# EAGLE design scr (EAGLE 7.4.0)
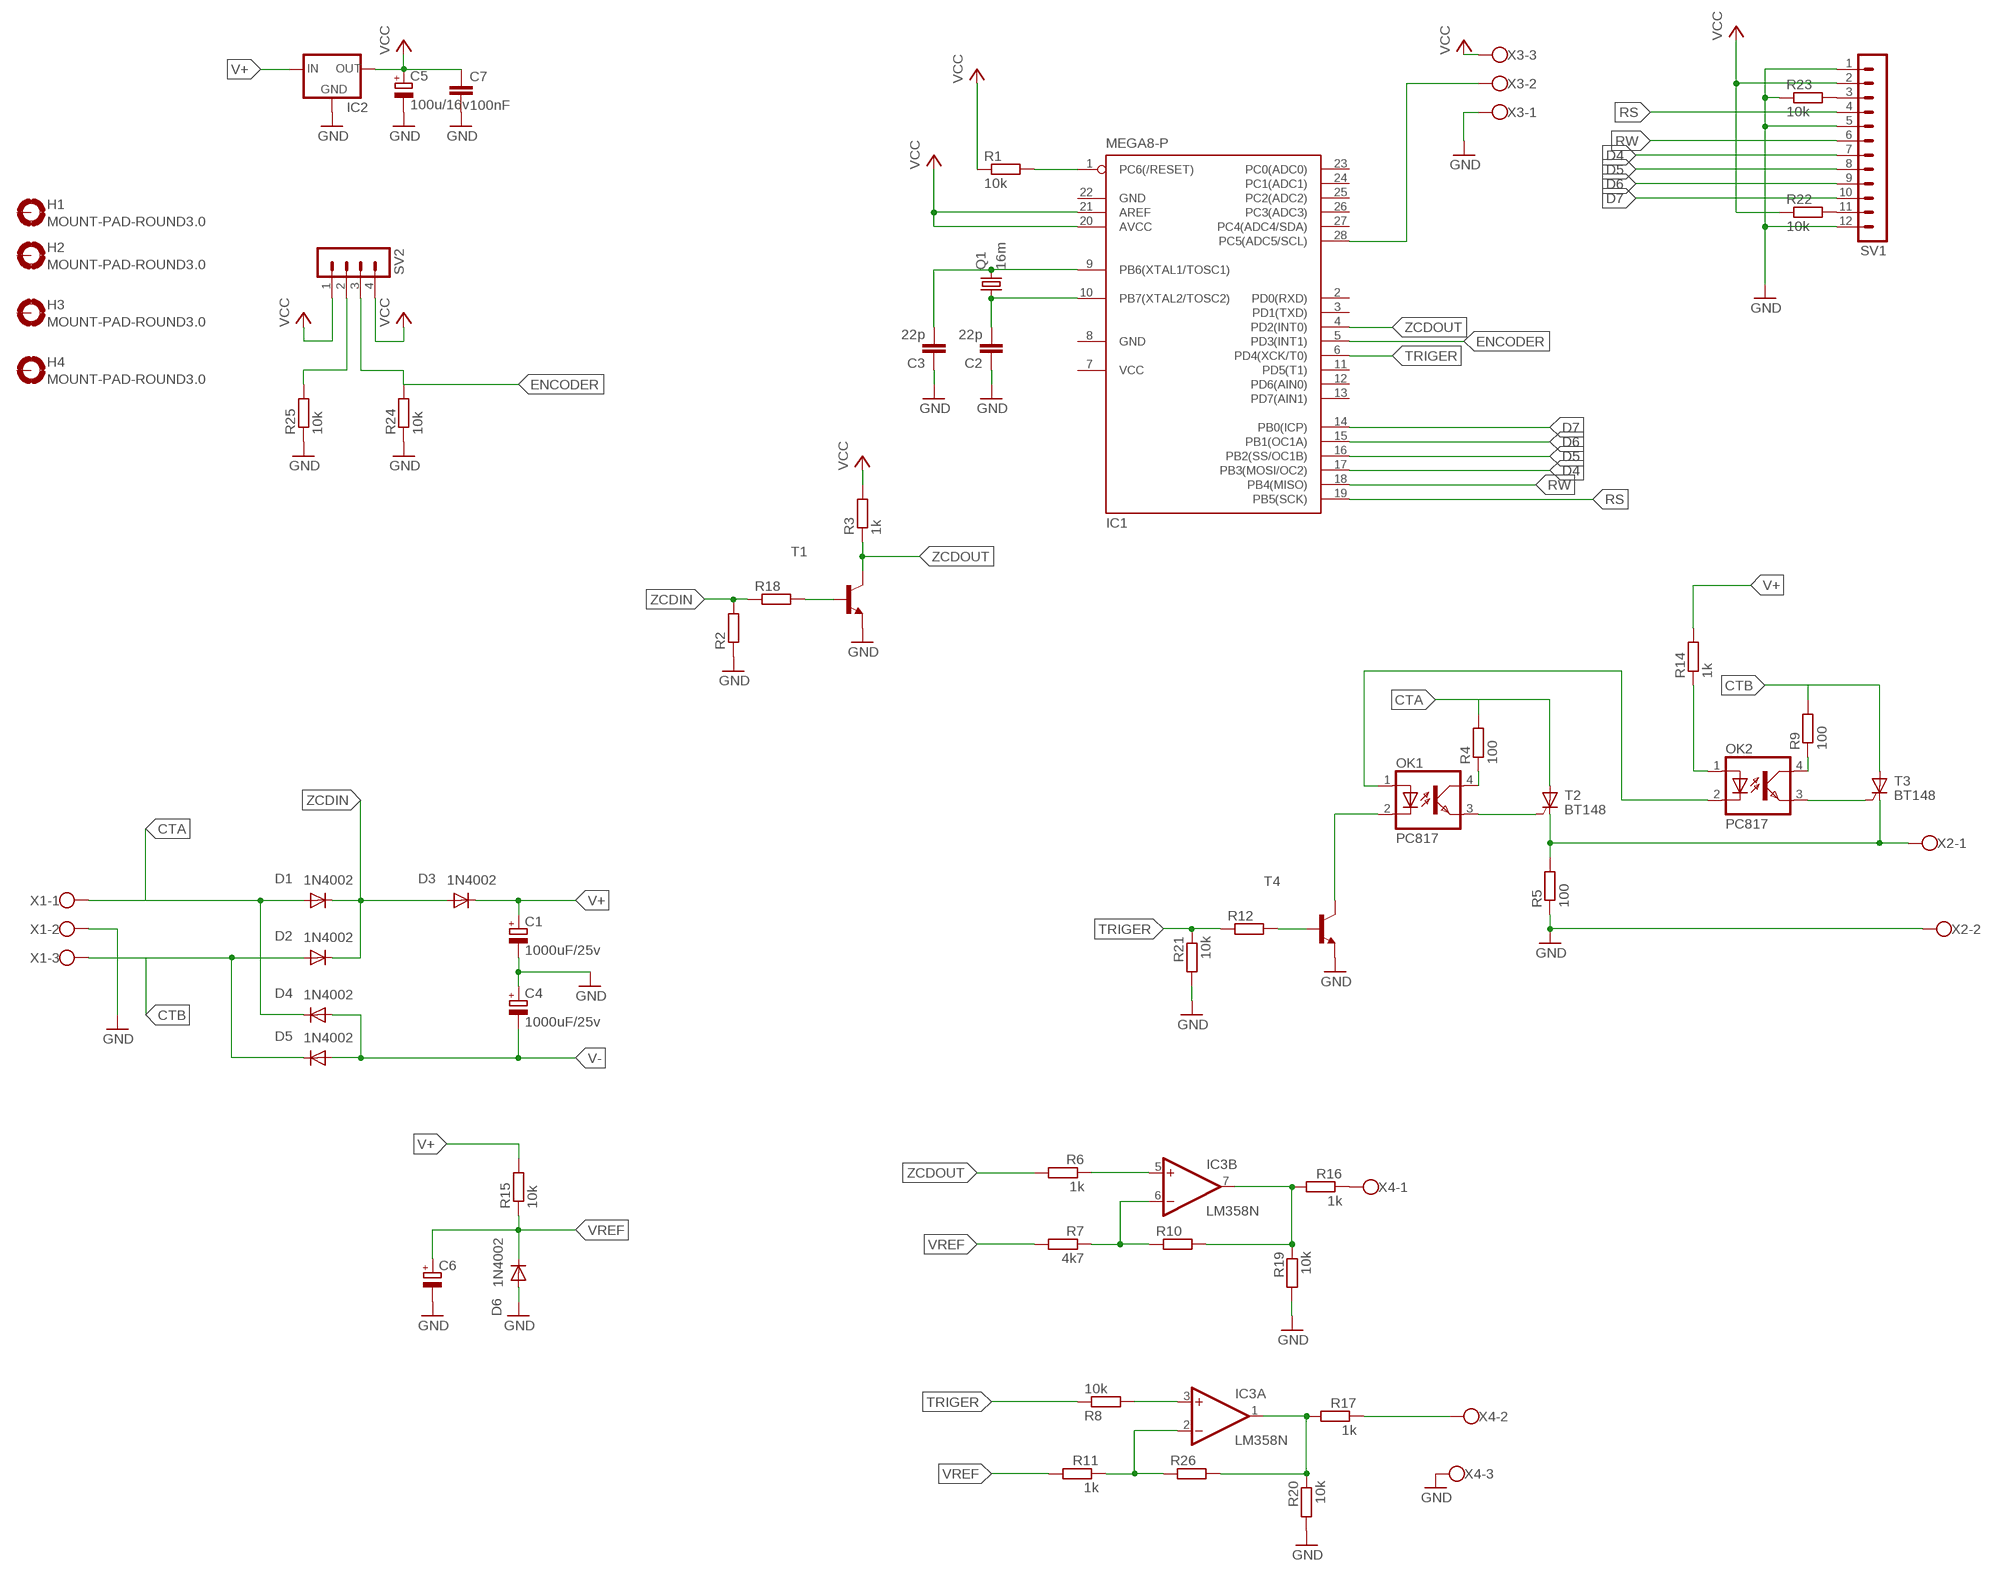
[diagram p0: schematic, sheet 1]

## Parts
C1  1000uF/25v  CPOL-EUE5-10.5  [E5-10,5]
C2  22p  C-EU025-025X050  [C025-025X050]
C3  22p  C-EU025-025X050  [C025-025X050]
C4  1000uF/25v  CPOL-EUE5-10.5  [E5-10,5]
C5  100u/16v  CPOL-EUE2.5-5  [E2,5-5]
C6  CPOL-EUE2.5-5  [E2,5-5]
C7  100nF  C-EU025-025X050  [C025-025X050]
D1  1N4002  1N4446  [DO35-10]
D2  1N4002  1N4446  [DO35-10]
D3  1N4002  1N4446  [DO35-10]
D4  1N4002  1N4446  [DO35-10]
D5  1N4002  1N4446  [DO35-10]
D6  1N4002  1N4446  [DO35-10]
H1  MOUNT-PAD-ROUND3.0  [3,0-PAD]
H2  MOUNT-PAD-ROUND3.0  [3,0-PAD]
H3  MOUNT-PAD-ROUND3.0  [3,0-PAD]
H4  MOUNT-PAD-ROUND3.0  [3,0-PAD]
IC1  MEGA8-P  [DIL28-3]
IC2  78XXS  [78XXS]
IC3  LM358N  [DIL08]
OK1  PC817  [DIL04]
OK2  PC817  [DIL04]
Q1  16m  CRYSTALHC49U-V  [HC49U-V]
R1  10k  R-EU_0207/10  [0207/10]
R2  R-EU_0207/2V  [0207/2V]
R3  1k  R-EU_0207/10  [0207/10]
R4  100  R-EU_0207/10  [0207/10]
R5  100  R-EU_0207/10  [0207/10]
R6  1k  R-EU_0207/10  [0207/10]
R7  4k7  R-EU_0207/10  [0207/10]
R8  10k  R-EU_0207/10  [0207/10]
R9  100  R-EU_0207/10  [0207/10]
R10  R-EU_0207/2V  [0207/2V]
R11  1k  R-EU_0207/10  [0207/10]
R12  R-EU_0207/2V  [0207/2V]
R14  1k  R-EU_0207/10  [0207/10]
R15  10k  R-EU_0207/10  [0207/10]
R16  1k  R-EU_0207/10  [0207/10]
R17  1k  R-EU_0207/10  [0207/10]
R18  R-EU_0207/2V  [0207/2V]
R19  10k  R-EU_0207/10  [0207/10]
R20  10k  R-EU_0207/10  [0207/10]
R21  10k  R-EU_0207/10  [0207/10]
R22  10k  R-EU_0207/10  [0207/10]
R23  10k  R-EU_0207/10  [0207/10]
R24  10k  R-EU_0207/10  [0207/10]
R25  10k  R-EU_0207/10  [0207/10]
R26  R-EU_0207/2V  [0207/2V]
SV1  MA12-1  [MA12-1]
SV2  MA04-1  [MA04-1]
T1  BC337-NPN-TO92-CBE  [TO92-CBE]
T2  BT148  [SOT82S]
T3  BT148  [SOT82S]
T4  BC337-NPN-TO92-CBE  [TO92-CBE]
X1  W237-103  [W237-103]
X2  W237-102  [W237-102]
X3  W237-103  [W237-103]
X4  W237-103  [W237-103]

## Nets
CTA: D1.A D4.C R4.2 T2.A X1.1
CTB: D2.A D5.C R9.2 T3.A X1.3
D4: IC1.17(PB3(MOSI/OC2)) SV1.7
D5: IC1.16(PB2(SS/OC1B)) SV1.8
D6: IC1.15(PB1(OC1A)) SV1.9
D7: IC1.14(PB0(ICP)) SV1.10
ENCODER: IC1.5(PD3(INT1)) R24.2 SV2.3
GND: C1.- C2.1 C3.1 C4.+ C5.- C6.- C7.2 D6.A IC2.GND R2.1 R5.1 R19.2 R20.2 R21.2 R23.1 R24.1 R25.1 SV1.1 SV1.5 SV1.12 T1.E T4.E X1.2 X2.2 X3.1 X4.3
N$1: IC1.1(PC6(/RESET)) R1.2
N$2: IC1.28(PC5(ADC5/SCL)) X3.2
N$3: R18.2 T1.B
N$4: R22.2 SV1.11
N$5: R23.2 SV1.3
N$6: C3.2 IC1.9(PB6(XTAL1/TOSC1)) Q1.2
N$7: IC3.3(A:+IN) R8.2
N$8: C2.2 IC1.10(PB7(XTAL2/TOSC2)) Q1.1
N$9: OK1.3(EMIT) T2.G
N$10: OK1.4(COL) R4.1
N$11: IC3.2(A:-IN) R11.1 R26.1
N$12: IC3.1(A:OUT) R17.2 R20.1 R26.2
N$13: R25.2 SV2.2
N$14: IC3.5(B:+IN) R6.1
N$15: IC3.6(B:-IN) R7.1 R10.1
N$16: IC3.7(B:OUT) R10.2 R16.2 R19.1
N$17: OK2.3(EMIT) T3.G
N$18: OK2.4(COL) R9.1
N$19: OK2.1(A) R14.1
N$20: R5.2 T2.C T3.C X2.1
N$21: OK1.1(A) OK2.2(C)
N$22: R12.2 T4.B
N$23: R16.1 X4.1
N$24: OK1.2(C) T4.C
N$26: R17.1 X4.2
RS: IC1.19(PB5(SCK)) SV1.4
RW: IC1.18(PB4(MISO)) SV1.6
TRIGER: IC1.6(PD4(XCK/T0)) R8.1 R12.1 R21.1
V+: C1.+ D3.C IC2.IN R14.2 R15.2
V-: C4.- D4.A D5.A
VCC: C5.+ C7.1 IC1.20(AVCC) IC1.21(AREF) IC2.OUT R1.1 R3.2 R22.1 SV1.2 SV2.1 SV2.4 X3.3
VREF: C6.+ D6.C R7.2 R11.2 R15.1
ZCDIN: D1.C D2.C D3.A R2.2 R18.1
ZCDOUT: IC1.4(PD2(INT0)) R3.1 R6.2 T1.C
Unconnected: H1.B3,0(MOUNT) H2.B3,0(MOUNT) H3.B3,0(MOUNT) H4.B3,0(MOUNT) IC1.2(PD0(RXD)) IC1.3(PD1(TXD)) IC1.11(PD5(T1)) IC1.12(PD6(AIN0)) IC1.13(PD7(AIN1)) IC1.23(PC0(ADC0)) IC1.24(PC1(ADC1)) IC1.25(PC2(ADC2)) IC1.26(PC3(ADC3)) IC1.27(PC4(ADC4/SDA))

## Power pins joined to a net without a drawn wire
GND: IC1.8(GND) IC1.22(GND)
V+: IC3.8(P:V+)
V-: IC3.4(P:V-)
VCC: IC1.7(VCC)

## Library data of the parts
C1 C4-C6 = rcl:CPOL-EU: POLARIZED CAPACITOR, European symbol
C2 C3 C7 = rcl:C-EU: CAPACITOR, European symbol
D1-D6 = diode:1N4446: DIODE high speed (Philips)
H1-H4 = holes:MOUNT-PAD-ROUND: MOUNTING PAD, round
IC1 = atmel:MEGA8-P: MICROCONTROLLER 8 Kbytes FLASH, 1 kbytes SRAM, 512 bytes EEPROM, USART, 4-channel 10 bit ADC, 2-channel 8 bit ADC Pin compatible with Atmega48, ATMega88, ATMega168 Source: avr.lbr; OC_FARNELL: unknown; OC_NEWARK: unknown
IC2 = v-reg:78XXS: VOLTAGE REGULATOR
IC3 = linear:LM358: OP AMP also LM158; LM258; LM2904 Source: http://cache.national.com/ds/LM/LM158.pdf
OK1 OK2 = optocoupler:PC817: SHARP OPTO COUPLER; MPN: PC817X4J000F; OC_FARNELL: 9707727; OC_NEWARK: 97K7059
Q1 = crystal:CRYSTAL: CRYSTAL; OC_FARNELL: 1666969; OC_NEWARK: unknown
R1-R12 R14-R26 = rcl:R-EU_: RESISTOR, European symbol
SV1 = con-lstb:MA12-1: PIN HEADER; OC_FARNELL: unknown; OC_NEWARK: unknown
SV2 = con-lstb:MA04-1: PIN HEADER; OC_FARNELL: unknown; OC_NEWARK: unknown
T1 T4 = transistor:*-NPN-: NPN Transistror BF959 corrected 2008.03.06
T2 T3 = triac:BT148: THYRISTOR
X1 X3 X4 = con-wago-500:W237-103: WAGO SCREW CLAMP; MPN: 237-103; OC_FARNELL: unknown; OC_NEWARK: 18M7116
X2 = con-wago-500:W237-102: WAGO SCREW CLAMP; MPN: 237-102; OC_FARNELL: unknown; OC_NEWARK: 70K9898

## Board
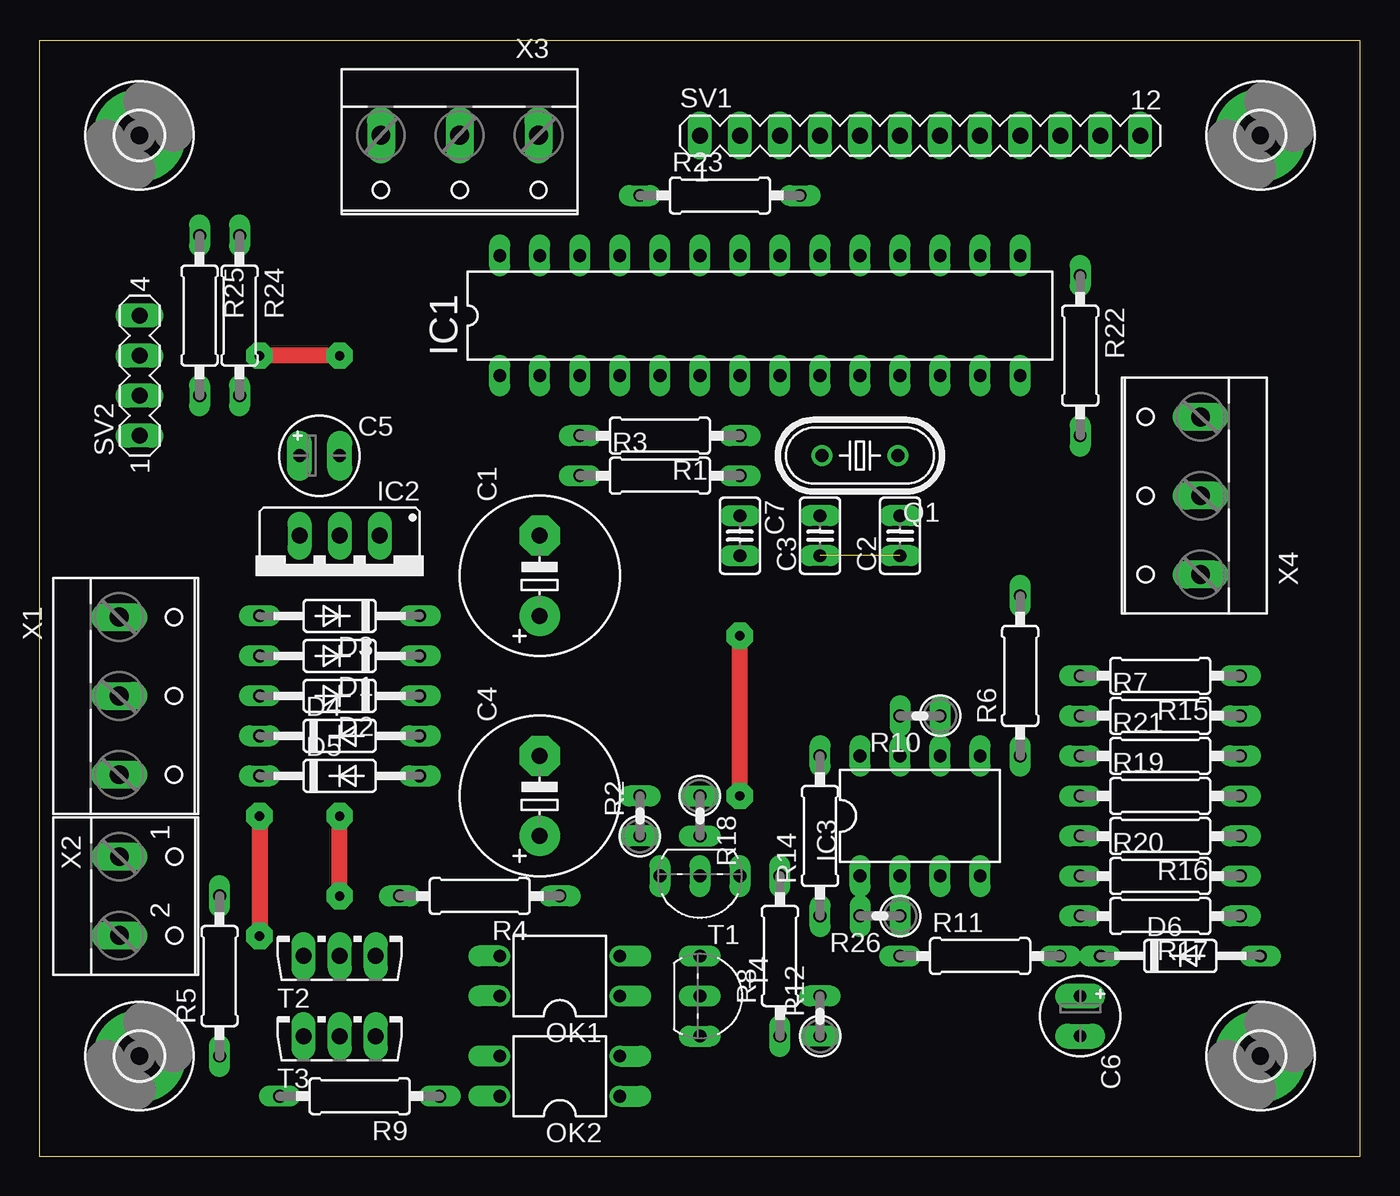
[diagram p1: board, top side]
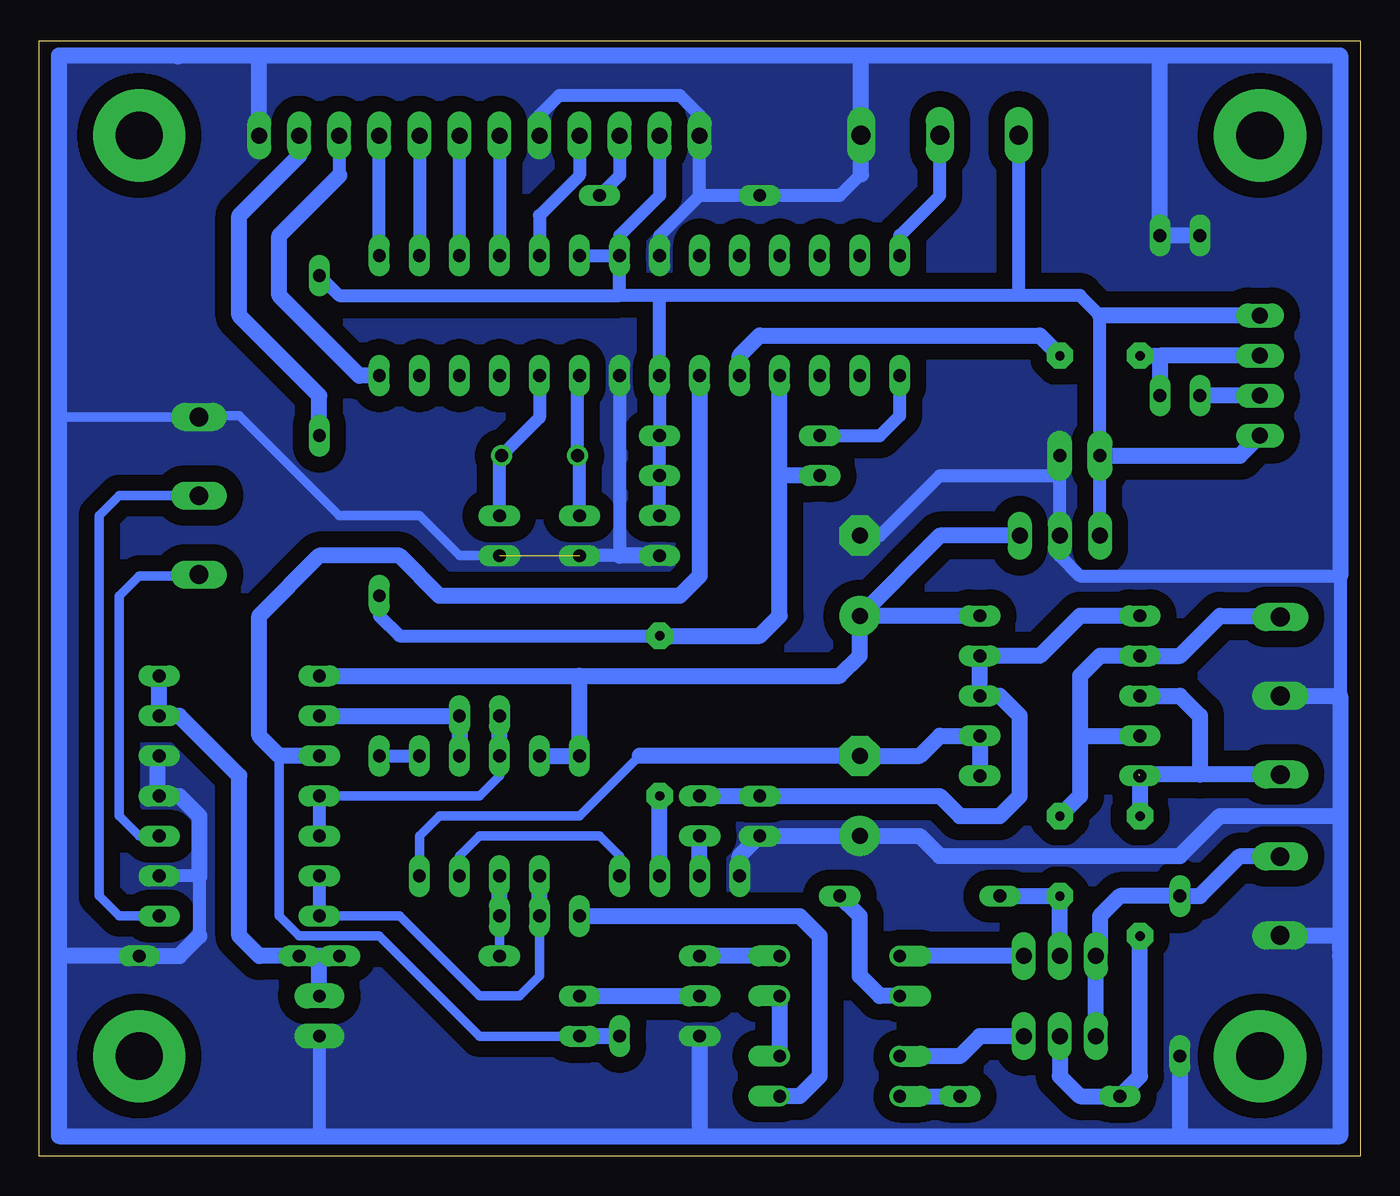
[diagram p2: board, bottom side, seen from below]

Size 83.8 x 70.79 mm. Coordinates in mm from the lower left corner, seen from the top.
Outline: 0,0 83.8,0 83.8,70.79 0,70.79 0,0
Copper layers (1*16): Top 0.035mm / dielectric 1.5mm / Bottom 0.035mm
Design rules "default": minimum track width 10mil, minimum drill 24mil, track to track 8mil, track to pad 8mil, pad to pad 8mil, via to via 8mil, smd to smd 8mil, copper to edge 40mil, drill to drill 8mil, minimum pad ring 10mil, minimum via ring 8mil, stop-mask expansion 4mil, vias tented up to drill 0mil, thermal gap 10mil

### Footprints (pad centres in the part's own frame; a part is rotated, then mirrored left to right if it is on the bottom)
E5-10,5 = drill 1.016 pad 2.54: + -2.54,0 | drill 1.016 pad 2.54 octagon: - 2.54,0
C025-025X050 = drill 0.813 long: 1 -1.27,0; 2 1.27,0
E2,5-5 = drill 0.813 pad 1.6 long: + -1.27,0; - 1.27,0
DO35-10 = drill 0.813 long: A 5.08,0; C -5.08,0
3,0-PAD = drill 3 pad 5.842: B3,0 0,0
DIL28-3 = drill 0.813 long: 1 -16.51,-3.81; 2 -13.97,-3.81; 3 -11.43,-3.81; 4 -8.89,-3.81; 5 -6.35,-3.81; 6 -3.81,-3.81; 7 -1.27,-3.81; 8 1.27,-3.81; 9 3.81,-3.81; 10 6.35,-3.81; 11 8.89,-3.81; 12 11.43,-3.81; 13 13.97,-3.81; 14 16.51,-3.81; 15 16.51,3.81; 16 13.97,3.81; 17 11.43,3.81; 18 8.89,3.81; 19 6.35,3.81; 20 3.81,3.81; 21 1.27,3.81; 22 -1.27,3.81; 23 -3.81,3.81; 24 -6.35,3.81; 25 -8.89,3.81; 26 -11.43,3.81; 27 -13.97,3.81; 28 -16.51,3.81
78XXS = drill 1.016 long: GND 0,-2.54; IN -2.54,-2.54; OUT 2.54,-2.54
DIL08 = drill 0.813 pad 1.27 long: 1 -3.81,-3.81; 2 -1.27,-3.81; 3 1.27,-3.81; 4 3.81,-3.81; 5 3.81,3.81; 6 1.27,3.81; 7 -1.27,3.81; 8 -3.81,3.81
DIL04 = drill 0.813 offset: 1 -1.27,-3.81; 2 1.27,-3.81; 3 1.27,3.81; 4 -1.27,3.81
HC49U-V = drill 0.813: 1 -2.413,0; 2 2.413,0
0207/10 = drill 0.813 long: 1 -5.08,0; 2 5.08,0
0207/2V = drill 0.813 long: 1 -1.27,0; 2 1.27,0
MA12-1 = drill 1.016 long: 1 -13.97,0; 2 -11.43,0; 3 -8.89,0; 4 -6.35,0; 5 -3.81,0; 6 -1.27,0; 7 1.27,0; 8 3.81,0; 9 6.35,0; 10 8.89,0; 11 11.43,0; 12 13.97,0
MA04-1 = drill 1.016 long: 1 -3.81,0; 2 -1.27,0; 3 1.27,0; 4 3.81,0
TO92-CBE = drill 0.813 long: B 0,0; C -2.54,0; E 2.54,0
SOT82S = drill 1.016 long: A 0,-1.27; C -2.286,-1.27; G 2.286,-1.27
W237-103 = drill 1.194 long: 1 -5,-1.29; 2 0,-1.29; 3 5,-1.29
W237-102 = drill 1.194 long: 1 -2.5,-1.27; 2 2.5,-1.27

### Placement (x,y rotation side)
C1  31.75,36.83 90 top
C2  54.61,39.37 90 top
C3  49.53,39.37 90 top
C4  31.75,22.86 90 top
C5  17.78,44.45 0 top
C6  66.04,8.89 270 top
C7  44.45,39.37 270 top
D1  19.05,31.75 180 top
D2  19.05,29.21 180 top
D3  19.05,34.29 180 top
D4  19.05,26.67 0 top
D5  19.05,24.13 0 top
D6  72.39,12.7 0 top
H1  6.35,6.35 0 top
H2  77.47,6.35 0 top
H3  77.47,64.77 0 top
H4  6.35,64.77 0 top
IC1  45.72,53.34 0 top
IC2  19.05,36.83 180 top
IC3  55.88,21.59 0 top
OK1  33.02,11.43 90 top
OK2  33.02,5.08 90 top
Q1  52.07,44.45 180 top
R1  39.37,45.72 180 top
R2  38.1,21.59 90 top
R3  39.37,43.18 0 top
R4  27.94,16.51 180 top
R5  11.43,11.43 90 top
R6  62.23,30.48 90 top
R7  71.12,27.94 0 top
R8  46.99,12.7 90 top
R9  20.32,3.81 180 top
R10  55.88,27.94 180 top
R11  59.69,12.7 0 top
R12  49.53,8.89 90 top
R14  49.53,20.32 90 top
R15  71.12,30.48 180 top
R16  71.12,20.32 180 top
R17  71.12,15.24 180 top
R18  41.91,21.59 270 top
R19  71.12,22.86 0 top
R20  71.12,17.78 0 top
R21  71.12,25.4 0 top
R22  66.04,50.8 270 top
R23  43.18,60.96 0 top
R24  12.7,53.34 270 top
R25  10.16,53.34 270 top
R26  53.34,15.24 180 top
SV1  55.88,64.77 0 top
SV2  6.35,49.53 90 top
T1  41.91,17.78 180 top
T2  19.05,13.97 0 top
T3  19.05,8.89 0 top
T4  41.91,10.16 270 top
X1  6.35,29.21 270 top
X2  6.35,16.51 270 top
X3  26.67,63.5 180 top
X4  72.39,41.91 90 top

### Tracks (layer width: path | path; a pad name or v marks a point on that pad's centre or on a via)
CTA  (via drill 0.6 pad 1.68)
  Top 1.016: v19.05,16.51 v19.05,21.59
  Bottom 1.016: 17.78,26.67 17.78,30.48 16.51,31.75 D1.A 11.43,31.75 8.89,34.29 5.14,34.29 X1.1 | 17.78,26.67 D4.C | 17.78,26.67 17.78,22.86 v19.05,21.59 | R4.2 v19.05,16.51 T2.A
CTB  (via drill 0.6 pad 1.68)  (1 unrouted)
  Top 1.016: v13.97,21.59 v13.97,13.97
  Bottom 1.016: X1.3 10.16,24.21 | 10.16,24.21 14.05,24.21 | D2.A 11.43,29.21 10.16,27.94 10.16,24.21 | v13.97,13.97 13.97,5.08 R9.2 17.78,3.81 19.05,5.08 T3.A | D5.C v13.97,21.59
D4
  Bottom 0.813: IC1.17 SV1.7
D5
  Bottom 0.813: SV1.8 IC1.16
D6
  Bottom 0.813: IC1.15 SV1.9
D7
  Bottom 0.813: SV1.10 64.77,62.23
  Bottom 1.016: IC1.14 63.5,49.53 68.58,54.61 68.58,58.42 64.77,62.23
ENCODER  (via drill 0.6 pad 1.68)
  Top 1.016: v19.05,50.8 v13.97,50.8
  Bottom 1.016: SV2.3 12.7,50.8 | 12.7,50.8 R24.2 | IC1.5 39.37,50.8 38.1,52.07 20.32,52.07 v19.05,50.8 | v13.97,50.8 12.7,50.8
GND  (1 unrouted)
  Bottom 0.61: 82.55,46.99 82.47,46.91 X4.3 73.6,46.99 71.12,46.99 64.77,40.64 59.69,40.64 57.15,38.1 C2.1
  Bottom 0.813: IC1.8 46.99,38.1 C3.1 | 19.05,43.18 IC2.GND 19.05,38.1 17.78,36.83 1.27,36.83 1.27,29.21 | 19.05,43.18 C5.- | C1.- 30.48,39.37 26.67,43.18 19.05,43.18 | IC1.22 44.45,58.42 41.91,60.96 | 41.91,60.96 SV1.1 41.91,66.04 43.18,67.31 50.8,67.31 52.07,66.04 SV1.5 | X3.1 31.67,62.31 33.02,60.96 R23.1 41.91,60.96 | R20.2 73.66,17.78 73.66,13.97 | C6.- 66.04,1.27
  Bottom 1.016: X1.2 1.27,29.21 1.27,21.59 | 1.27,21.59 1.27,12.7 | 1.27,12.7 1.27,1.27 11.43,1.27 | 41.91,1.27 66.04,1.27 82.55,1.27 82.55,12.7 | 41.91,1.27 11.43,1.27 | X2.2 1.31,14.01 1.27,12.7 | 82.55,12.7 82.55,46.99 82.55,69.85 74.93,69.85 | 74.93,69.85 69.85,69.85 | 69.85,69.85 31.75,69.85 | 31.75,69.85 12.7,69.85 | 12.7,69.85 1.27,69.85 1.27,36.83 | 31.67,62.31 31.67,69.77 31.75,69.85 | 75.01,69.77 74.93,69.85 | SV1.12 69.85,69.85 | C7.2 46.99,38.1 | R25.1 R24.1 12.7,69.85 | T4.E 41.91,1.27 | 1.27,21.59 8.89,21.59 11.43,19.05 26.67,19.05 27.94,20.32 C4.+ R2.1 39.37,19.05 T1.E | R5.1 11.43,1.27 | 82.55,12.7 D6.A 74.93,12.7 73.66,13.97 | 73.66,17.78 73.66,21.59 74.93,22.86 R19.2 76.28,22.94 76.28,25.32 R21.2
  pour Bottom (isolate 1.016, no thermals): 1.27,71.12 83.82,71.12 83.82,0 0,0 0,71.12
N$1
  Bottom 0.813: R1.2 30.48,45.72 29.21,46.99 IC1.1
N$2
  Bottom 0.813: IC1.28 29.21,58.42 26.67,60.96 X3.2
N$3
  Bottom 1.016: T1.B R18.2
N$4
  Bottom 1.016: R22.2 66.04,48.26 71.12,53.34 71.12,59.69 67.31,63.5 SV1.11
N$5
  Bottom 0.813: SV1.3 46.99,62.23 R23.2
N$6
  Bottom 0.813: IC1.9 49.66,49.4 Q1.2 49.53,44.32 C3.2
N$7
  Bottom 0.61: IC3.3 57.15,19.05 55.88,20.32 48.26,20.32 46.99,19.05 R8.2
N$8
  Bottom 0.813: IC1.10 52.07,46.86 Q1.1 54.61,44.32 C2.2
N$9
  Bottom 1.016: T2.G OK1.3
N$10
  Bottom 1.016: OK1.4 30.48,10.16 31.75,11.43 31.75,15.24 R4.1
N$11
  Bottom 0.61: R11.1 R26.1
  Bottom 1.016: R26.1 IC3.2
N$12
  Bottom 0.61: IC3.1 52.07,11.43 53.34,10.16 55.88,10.16 60.96,15.24 R17.2
  Bottom 0.813: R20.1 R17.2
  Bottom 1.016: R26.2 IC3.1
N$13
  Bottom 1.016: SV2.2 R25.2
N$14
  Bottom 0.813: R6.1 IC3.5
N$15
  Bottom 0.813: IC3.6 57.15,26.67
  Bottom 1.016: IC3.6 R10.1 R7.1
N$16
  Bottom 0.61: R19.1 55.88,22.86 54.61,24.13 IC3.7
  Bottom 0.813: R19.1 R16.2
  Bottom 1.016: IC3.7 R10.2
N$17
  Bottom 1.016: T3.G 24.13,7.62 25.4,6.35 OK2.3
N$18
  Bottom 1.016: OK2.4 R9.1
N$19
  Bottom 1.016: R14.1 35.56,15.24 34.29,13.97 34.29,5.08 35.56,3.81 OK2.1
N$20
  Bottom 1.016: T3.C T2.C 16.51,12.95 16.51,15.24 15.24,16.51 R5.2 10.16,16.51 7.66,19.01 X2.1
N$21
  Bottom 1.016: OK1.1 OK2.2
N$22
  Bottom 1.016: R12.2 T4.B
N$23
  Bottom 0.61: R16.1 77.47,20.32 78.74,21.59 78.74,35.56 77.47,36.83 73.76,36.83 X4.1
N$24
  Bottom 1.016: OK1.2 T4.C
N$26
  Bottom 0.61: R17.1 78.74,15.24 80.01,16.51 80.01,40.64 78.74,41.91 X4.2
RS
  Bottom 0.813: SV1.4 49.53,62.23 52.07,59.69 IC1.19
RW
  Bottom 0.813: SV1.6 IC1.18
TRIGER
  Bottom 0.61: R12.1 55.88,7.62 62.23,13.97 67.31,13.97 68.58,15.24 68.58,25.4
  Bottom 1.016: IC1.6 41.91,36.83 43.18,35.56 58.42,35.56 60.96,38.1 66.04,38.1 69.85,34.29 69.85,26.67 68.58,25.4 R21.1 | R8.1 R12.1
V+
  Bottom 1.016: D3.C C1.+ | IC2.IN 26.67,39.37 C1.+ | 49.53,30.48 R14.2 IC3.8 | 49.53,30.48 33.02,30.48 31.75,31.75 C1.+ | R15.2 49.53,30.48
V-
  Bottom 0.61: IC3.4 59.69,20.32 58.42,21.59 49.53,21.59 45.72,25.4
  Bottom 1.016: D5.A D4.A 26.67,26.67 27.94,25.4 C4.- 45.72,25.4
VCC
  Bottom 0.813: C7.1 R3.2 R1.1 IC1.7 44.45,54.61 | 44.45,54.61 46.99,54.61 | 46.99,54.61 IC1.21 | IC1.20 IC1.21 | IC2.OUT C5.+ 16.51,53.34 17.78,54.61 21.59,54.61 | SV1.2 44.45,60.96 46.99,58.42 IC1.21 | 21.59,54.61 44.45,54.61 | X3.3 21.67,54.69 21.59,54.61 | R22.1 64.77,54.61 46.99,54.61
  Bottom 1.016: C5.+ 7.62,44.45 SV2.1 | SV2.4 16.51,53.34
VREF
  Bottom 0.61: 64.77,10.16 C6.+
  Bottom 1.016: R15.1 R7.2 74.93,27.94 71.12,24.13 71.12,13.97 69.85,12.7 D6.C | R11.2 D6.C | C6.+ 66.04,12.7 D6.C
ZCDIN
  Bottom 1.016: D3.A 17.78,34.29 20.32,31.75 D1.C D2.C 22.86,29.21 21.59,27.94 21.59,22.86 22.86,21.59 25.4,21.59 26.67,22.86 R2.2 R18.1
ZCDOUT  (via drill 0.6 pad 1.68)
  Top 1.016: v44.45,22.86 v44.45,33.02
  Bottom 0.813: R6.2 62.23,34.29 60.96,33.02 v44.45,33.02
  Bottom 1.016: T1.C v44.45,22.86 | v44.45,33.02 38.1,33.02 36.83,34.29 36.83,43.18 | 36.83,43.18 IC1.4 | R3.1 36.83,43.18